# Altium project PCB_Project.PrjPcb
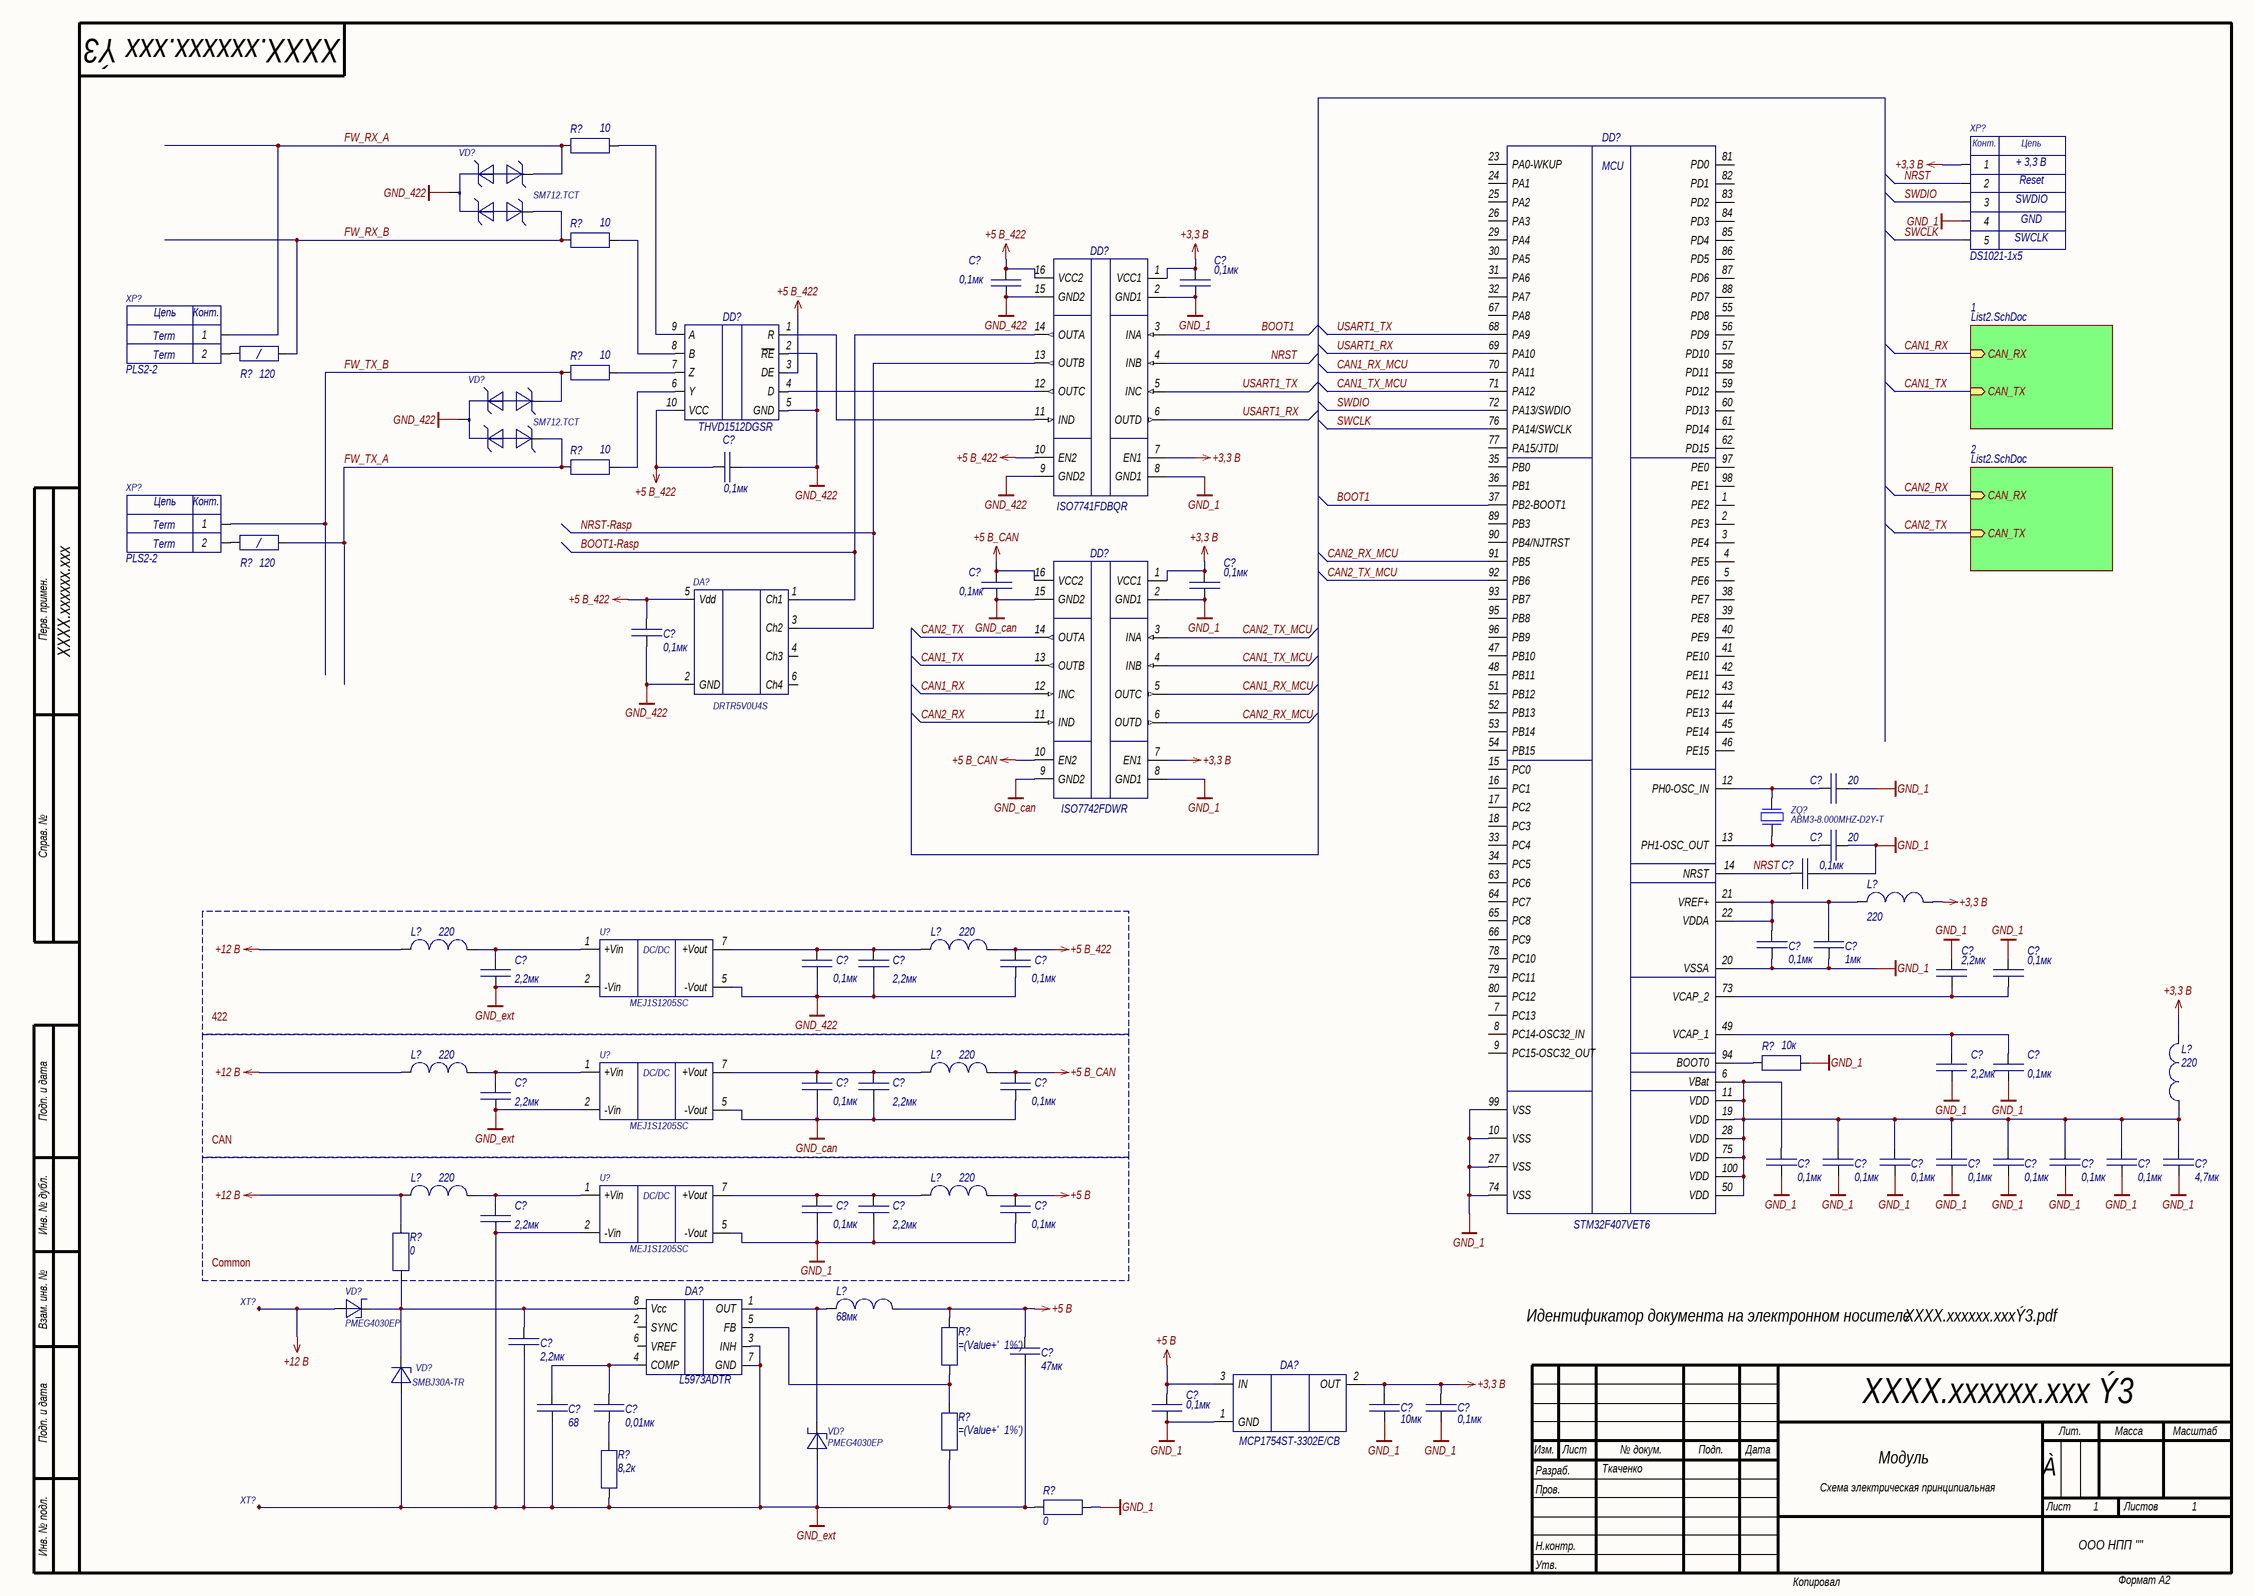
[diagram p0: List1.SchDoc]
DocumentNumber: XXXX.xxxxxx.xxx Ý3; DocumentType2str: Схема электрическая принципиальная; DrawnBy: Ткаченко; IDENT: XXXX.xxxxxx.xxxÝ3.pdf; ImagePath: XXXX.xxxxxx.xxx; Letter1Column: À; Organization: ООО НПП ''''; pcbvalue: КНТР.777777.123; Title2str: Модуль
2 sheets, 104 parts. Net scope: hierarchical (ports join the sheet entries above them; power ports are global).
Board file: pcb.PcbDoc
Sheets:
  List1.SchDoc
    1 = List2.SchDoc
    2 = List2.SchDoc

## Sheet List1.SchDoc
size 594 x 420 mm; DrawnBy: Ткаченко; Organization: ООО НПП ''''; DocumentNumber: XXXX.xxxxxx.xxx Ý3; SheetNumber: 1; SheetTotal: 1; Scale: 1:1; PageSetup: Record=PageOptions|CenterHorizontal=False|CenterVertical=False|PrintScale=0.95|XCorrection=0.00|YCorrection=0.00|PrintKind=1|BorderSize=5000000|LeftOffset=0|BottomOffset=0|Orientation=1|PaperLength=1000|PaperWidth=1000|Scale=100|PaperSource=15|PrintQuality=600|MediaType=1|DitherType=10|PaperKind=A4|PrintScaleMode=1; Title2str: Модуль; DocumentType2str: Схема электрическая принципиальная; TitleProject: Модуль; IDENT: XXXX.xxxxxx.xxxÝ3.pdf; ImagePath: XXXX.xxxxxx.xxx; Rule: PcbType=ProtelPcb

### Parts
(Parts that share a designator on the sheet are numbered #1, #2 ... from top to bottom, then left to right.)
C?#1  0,1мк  [CAPC1608N_SL]
C?#2  0,1мк  [CAPC1608N_SL]
C?#3  0,1мк  [CAPC1608N_SL]
C?#4  0,1мк  [CAPC1608N_SL]
C?#5  0,1мк  [CAPC1608N_SL]
C?#6  0,1мк  [CAPC1608N_SL]
C?#7  20  [CAPC1608N_SL]
C?#8  20  [CAPC1608N_SL]
C?#9  0,1мк  [CAPC1608N_SL]
C?#10  0,1мк  [CAPC1608N_SL]
C?#11  1мк  [CAPC1608N_SL]
C?#12  2,2мк  [CAPC1608N]
C?#13  0,1мк  [CAPC1608N_SL]
C?#14  2,2мк  [CAPC3216N]
C?#15  0,1мк  [CAPC1608N_SL]
C?#16  2,2мк  [CAPC3216N]
C?#17  0,1мк  [CAPC1608N_SL]
C?#18  2,2мк  [CAPC1608N]
C?#19  0,1мк  [CAPC1608N_SL]
C?#20  0,1мк  [CAPC1608N_SL]
C?#21  2,2мк  [CAPC3216N]
C?#22  0,1мк  [CAPC1608N_SL]
C?#23  2,2мк  [CAPC3216N]
C?#24  0,1мк  [CAPC1608N_SL]
C?#25  0,1мк  [CAPC1608N_SL]
C?#26  0,1мк  [CAPC1608N_SL]
C?#27  0,1мк  [CAPC1608N_SL]
C?#28  0,1мк  [CAPC1608N_SL]
C?#29  0,1мк  [CAPC1608N_SL]
C?#30  0,1мк  [CAPC1608N_SL]
C?#31  4,7мк  [CAPC1608N_SL]
C?#32  0,1мк  [CAPC1608N_SL]
C?#33  2,2мк  [CAPC3216N]
C?#34  0,1мк  [CAPC1608N_SL]
C?#35  2,2мк  [CAPC3216N]
C?#36  2,2мк  [CAPC3216N]
C?#37  47мк  [CAPC3225N]
C?#38  68  [CAPC1608N_SL]
C?#39  0,01мк  [CAPC1608N_SL]
C?#40  0,1мк  [CAPC1608N_sl]
C?#41  10мк  [CAPC2012N]
C?#42  0,1мк  [CAPC1608N_sl]
DA?#1  DRTR5V0U4S  [SOT363]
DA?#2  L5973ADTR  [SOIC8(with_termopad)]
DA?#3  MCP1754ST-3302E/CB  [SOT23-3N]
DD?#1  ISO7741FDBQR  [SSOP16]
DD?#2  THVD1512DGSR  [VSOP-10]
DD?#3  ISO7742FDWR  [SO16_N]
DD?#4  STM32F407VET6  [LQFP100]
L?#1  220  [L2012N]
L?#2  220  [L2012N]
L?#3  220  [L2012N]
L?#4  220  [L2012N]
L?#5  220  [L2012N]
L?#6  220  [L2012N]
L?#7  220  [L2012N]
L?#8  220  [L2012N]
L?#9  68мк  [CDRH104R]
R?#1  10  [RESC1608N_SL]
R?#2  10  [RESC1608N_SL]
R?#3  120  [RESC3216N]
R?#4  10  [RESC1608N_SL]
R?#5  10  [RESC1608N_SL]
R?#6  120  [RESC3216N]
R?#7  10к  [RESC1608N_SL]
R?#8  0  [RESC1608N_SL]
R?#9  (no value)  [RESC1608N_SL]
R?#10  (no value)  [RESC1608N_SL]
R?#11  8,2к  [RESC1608N_SL]
R?#12  0  [RESC1608N_SL]
U?#1  MEJ1S1205SC  [MEJ1S1205SC]
U?#2  MEJ1S1205SC  [MEJ1S1205SC]
U?#3  MEJ1S1205SC  [MEJ1S1205SC]
VD?#1  SM712.TCT  [SOT23-3N]
VD?#2  SM712.TCT  [SOT23-3N]
VD?#3  PMEG4030EP  [SOD128]
VD?#4  SMBJ30A-TR  [DO-214AA(SMB)]
VD?#5  PMEG4030EP  [SOD128]
XP?#1  DS1021-1x5  Net_Name1: + 3,3 В  Net_Name2: Reset  Net_Name3: SWDIO  Net_Name4: GND  Net_Name5: SWCLK  [PLS-5]
XP?#2  PLS2-2  Net_Name1: Term  [PLS2-2]
XP?#3  PLS2-2  Net_Name1: Term  [PLS2-2]
XT?#1  PAD  [Pad_1.3X0.8]  (value not drawn)  (no BOM)
XT?#2  PAD  [Pad_1.3X0.8]  (value not drawn)  (no BOM)
ZQ?  ABM3-8.000MHZ-D2Y-T  [ABM3]

### Blocks framed on the sheet
422: C?#13-C?#16 L?#2 L?#3 U?#1

### Sub-sheets
1 = List2.SchDoc: CAN_RX (in), CAN_TX (in)
2 = List2.SchDoc: CAN_RX (in), CAN_TX (in)

### Nets
+3,3 В: C?#2.1 C?#5.1 C?#41.1 C?#42.1 DA?#3.2(OUT) DD?#1.1(VCC1) DD?#1.7(EN1) DD?#3.1(VCC1) DD?#3.7(EN1) L?#1.2 L?#6.2 XP?#1.1
+5 В: C?#34.1 C?#37.1 C?#40.1 DA?#3.3(IN) L?#8.2 L?#9.2 R?#9.2
+5 В_422: C?#1.1 C?#3.1 C?#6.2 C?#15.1 DA?#1.5(Vdd) DD?#1.10(EN2) DD?#1.16(VCC2) DD?#2.3(DE) DD?#2.10(VCC) L?#3.2
+5 В_CAN: C?#4.1 C?#22.1 DD?#3.10(EN2) DD?#3.16(VCC2) L?#5.2
+12 В: L?#2.1 L?#4.1 L?#7.1 R?#8.2 VD?#3.2(A) XT?#1.1
GND_1: C?#2.2 C?#5.2 C?#7.1 C?#8.1 C?#9.1 C?#10.2 C?#11.2 C?#12.2 C?#17.1 C?#18.1 C?#19.2 C?#24.2 C?#25.2 C?#26.2 C?#27.2 C?#28.2 C?#29.2 C?#30.2 C?#31.2 C?#32.2 C?#33.2 C?#34.2 C?#40.2 C?#41.2 C?#42.2 DA?#3.1(GND) DD?#1.2(GND1) DD?#1.8(GND1) DD?#3.2(GND1) DD?#3.8(GND1) DD?#4.10(VSS) DD?#4.20(VSSA) DD?#4.27(VSS) DD?#4.74(VSS) DD?#4.99(VSS) R?#7.2 R?#12.2 U?#3.5(-Vout) XP?#1.4
GND_422: C?#1.2 C?#3.2 C?#6.1 C?#13.2 C?#14.2 C?#15.2 DA?#1.2(GND) DD?#1.9(GND2) DD?#1.15(GND2) DD?#2.2(~{RE}) DD?#2.5(GND) U?#1.5(-Vout) VD?#1.3(C3) VD?#2.3(C3)
GND_can: C?#4.2 C?#20.2 C?#21.2 C?#22.2 DD?#3.9(GND2) DD?#3.15(GND2) U?#2.5(-Vout)
GND_ext: C?#16.2 C?#23.2 C?#35.2 C?#36.2 C?#37.2 C?#38.2 DA?#2.3(INH) DA?#2.7(GND) R?#10.1 R?#11.1 R?#12.1 U?#1.2(-Vin) U?#2.2(-Vin) U?#3.2(-Vin) VD?#4.2 VD?#5.2(A) XT?#2.1
BOOT1: DD?#1.3(INA) DD?#4.37(PB2-BOOT1)
BOOT1-Rasp: DA?#1.1(Ch1) DD?#1.14(OUTA)
CAN1_RX: DD?#3.12(INC) ; sheet 1/CAN_RX
CAN1_RX_MCU: DD?#3.5(OUTC) DD?#4.70(PA11)
CAN1_TX: DD?#3.13(OUTB) ; sheet 1/CAN_TX
CAN1_TX_MCU: DD?#3.4(INB) DD?#4.71(PA12)
CAN2_RX: DD?#3.11(IND) ; sheet 2/CAN_RX
CAN2_RX_MCU: DD?#3.6(OUTD) DD?#4.91(PB5)
CAN2_TX: DD?#3.14(OUTA) ; sheet 2/CAN_TX
CAN2_TX_MCU: DD?#3.3(INA) DD?#4.92(PB6)
FW_RX_A: R?#1.1 VD?#1.1(C1) XP?#2.1
FW_RX_B: R?#2.1 R?#3.2 VD?#1.2(C2)
FW_TX_A: R?#5.1 R?#6.2 VD?#2.2(C2)
FW_TX_B: R?#4.1 VD?#2.1(C1) XP?#3.1
NRST: C?#9.2 DD?#1.4(INB) DD?#4.14(NRST) XP?#1.2
NRST-Rasp: DA?#1.3(Ch2) DD?#1.13(OUTB)
SWCLK: DD?#4.76(PA14/SWCLK) XP?#1.5
SWDIO: DD?#4.72(PA13/SWDIO) XP?#1.3
USART1_RX: DD?#1.6(OUTD) DD?#4.69(PA10)
USART1_TX: DD?#1.5(INC) DD?#4.68(PA9)
NetC?#7_2: C?#7.2 DD?#4.12(PH0-OSC_IN) ZQ?.2
NetC?#8_2: C?#8.2 DD?#4.13(PH1-OSC_OUT) ZQ?.1
NetC?#10_1: C?#10.1 C?#11.1 DD?#4.21(VREF+) DD?#4.22(VDDA) L?#1.1
NetC?#12_1: C?#12.1 C?#17.2 DD?#4.73(VCAP_2)
NetC?#13_1: C?#13.1 C?#14.1 L?#3.1 U?#1.7(+Vout)
NetC?#16_1: C?#16.1 L?#2.2 U?#1.1(+Vin)
NetC?#18_2: C?#18.2 C?#19.1 DD?#4.49(VCAP_1)
NetC?#20_1: C?#20.1 C?#21.1 L?#5.1 U?#2.7(+Vout)
NetC?#23_1: C?#23.1 L?#4.2 U?#2.1(+Vin)
NetC?#24_1: C?#24.1 C?#25.1 C?#26.1 C?#27.1 C?#28.1 C?#29.1 C?#30.1 C?#31.1 DD?#4.6(VBat) DD?#4.11(VDD) DD?#4.19(VDD) DD?#4.28(VDD) DD?#4.50(VDD) DD?#4.75(VDD) DD?#4.100(VDD) L?#6.1
NetC?#32_1: C?#32.1 C?#33.1 L?#8.1 U?#3.7(+Vout)
NetC?#35_1: C?#35.1 L?#7.2 U?#3.1(+Vin)
NetC?#36_1: C?#36.1 DA?#2.8(Vcc) R?#8.1 VD?#3.1(C) VD?#4.1
NetC?#38_1: C?#38.1 C?#39.1 DA?#2.4(COMP)
NetC?#39_2: C?#39.2 R?#11.2
NetDA?#2_1: DA?#2.1(OUT) L?#9.1 VD?#5.1(C)
NetDA?#2_5: DA?#2.5(FB) R?#9.1 R?#10.2
NetDD?#1_11: DD?#1.11(IND) DD?#2.1(R)
NetDD?#1_12: DD?#1.12(OUTC) DD?#2.4(D)
NetDD?#2_6: DD?#2.6(Y) R?#5.2
NetDD?#2_7: DD?#2.7(Z) R?#4.2
NetDD?#2_8: DD?#2.8(B) R?#2.2
NetDD?#2_9: DD?#2.9(A) R?#1.2
NetDD?#4_94: DD?#4.94(BOOT0) R?#7.1
NetR?#3_1: R?#3.1 XP?#2.2
NetR?#6_1: R?#6.1 XP?#3.2

Not connected (* = marked no-connect by the designer): DA?#1 4(Ch3) 6(Ch4); DA?#2 2(SYNC) 6(VREF); DD?#4 1(PE2) 2(PE3) 3(PE4) 4(PE5) 5(PE6) 7(PC13) 8(PC14-OSC32_IN) 9(PC15-OSC32_OUT) 15(PC0) 16(PC1) 17(PC2) 18(PC3) 23(PA0-WKUP) 24(PA1) 25(PA2) 26(PA3) 29(PA4) 30(PA5) 31(PA6) 32(PA7) 33(PC4) 34(PC5) 35(PB0) 36(PB1) 38(PE7) 39(PE8) 40(PE9) 41(PE10) 42(PE11) 43(PE12) 44(PE13) 45(PE14) 46(PE15) 47(PB10) 48(PB11) 51(PB12) 52(PB13) 53(PB14) 54(PB15) 55(PD8) 56(PD9) 57(PD10) 58(PD11) 59(PD12) 60(PD13) 61(PD14) 62(PD15) 63(PC6) 64(PC7) 65(PC8) 66(PC9) 67(PA8) 77(PA15/JTDI) 78(PC10) 79(PC11) 80(PC12) 81(PD0) 82(PD1) 83(PD2) 84(PD3) 85(PD4) 86(PD5) 87(PD6) 88(PD7) 89(PB3) 90(PB4/NJTRST) 93(PB7) 95(PB8) 96(PB9) 97(PE0) 98(PE1)

### Notes on the sheet
- CAN
- Common
- Перв. примен.
- Справ. №
- Подп. и дата
- Инв. № дубл.
- Взам. инв. №
- Идентификатор документа на электронном носителе
- Изм.
- Лист
- № докум.
- Подп.
- Дата
- Лит.
- Масса
- Масштаб
- Пров.
- Разраб.
- Листов
- Инв. № подл.
- Н.контр.
- Утв.
- Копировал
- Формат А2
- (in symbol DS1021-1x5_Сonnfly) Конт.; Цепь
- (in symbol MEJ1S1205SC_Murata Electronics) DC/DC
- (in symbol PLS2-2_CONNFLY) Цепь; Конт.
- (in symbol STM32F407VET6_STMicroelectronics) MCU

### Library data of the parts
C?#1-C?#6 C?#9 C?#10 C?#13 C?#15 C?#17 C?#19 C?#20 C?#22 C?#24-C?#30 C?#32 C?#34 = CC0603KRX7R0BB104_Yageo: 0.1µF ±10% 100V Ceramic Capacitor X7R 0603 (1608 Metric); Manufacturer: Yageo; Voltage: 100 В; ValueBOM: Конденсатор CC0603KRX7R0BB104 "Yageo" (0,1 мкФ ± 10 %, 100 В, X7R, SMD 0603); Sorting: 100000; Автор: Ткаченко М.; Количество1: 1; Цена1: 0,21; Количество2: 10; Цена2: 0,14; Разрешен к применению: True; PartNumber: CC0603KRX7R0BB104_Yageo; ManufacturerPartNumber: CC0603KRX7R0BB104; ComponentLink3URL: http://www.yageo.com/documents/recent/UPY-NP0X7R_MV_100-to-630V_18.pdf; ComponentLink3Description: Datasheet; Value: 0,1мк; Tolerance: ± 10 %; TKE: X7R; ComponentLink2Description: Manufacturer Link; ComponentLink2URL: http://www.yageo.com/; Operating Temperature: -55°C ~ +125°C; Modify: 27.02.2017 8:51:43; Supplier: Digi-Key; Supplier P/N: 311-1523-1-ND
C?#7 C?#8 = CC0603JRNPO9BN200_Yageo: CAP CER 20PF 50V 5% NPO 0603; Manufacturer: Yageo; Voltage: 50 В; TKE: NP0; ValueBOM: Конденсатор CC0603JRNPO9BN200 "Yageo" (20 пФ ± 10 %, 50 В,NP0, SMD 0603); Автор: Хоменко С.П.; Количество1: 10; Цена1: 0,031; Количество2: 25; Цена2: 0,0216; Разрешен к применению: True; PartNumber: CC0603JRNPO9BN200_Yageo; ManufacturerPartNumber: CC0603JRNPO9BN200; ComponentLink3URL: http://www.yageo.com/documents/recent/UPY-GPHC_X7R_6.3V-to-50V-v12.pdf; ComponentLink3Description: Datasheet; Value: 20; Tolerance: ± 5 %; ComponentLink2Description: Manufacturer Link; ComponentLink2URL: http://www.yageo.com/; Operating Temperature: -55°C ~ +125°C; Modify: 12.08.2015; Supplier: Digi-Key; Supplier P/N: 311-1424-1-ND; Sorting: 20
C?#11 = CC0603KRX7R7BB105_Yageo: CAP CER 1UF 16V 10% X7R 0603; Manufacturer: Yageo; Voltage: 16 В; ValueBOM: Конденсатор CC0603KRX7R7BB105 "Yageo" (1 мкФ ± 10 %, 16 В,X7R, SMD 0603); Sorting: 1000000; Автор: Хоменко С.П.; Количество1: 10; Цена1: 0,44; Количество2: 25; Цена2: 0,031; Разрешен к применению: True; PartNumber: CC0603KRX7R7BB105_Yageo; ManufacturerPartNumber: CC0603KRX7R7BB105; ComponentLink3URL: http://www.yageo.com/documents/recent/UPY-GPHC_X7R_6.3V-to-50V-v12.pdf; ComponentLink3Description: Datasheet; Value: 1мк; Tolerance: ± 10 %; TKE: X7R; ComponentLink2Description: Manufacturer Link; ComponentLink2URL: http://www.yageo.com/; Operating Temperature: -55°C ~ +125°C; Modify: 12.08.2015 16:30:29; Supplier: Digi-Key; Supplier P/N: 311-1446-1-ND
C?#12 C?#18 = GRM188R71A225KE15D_Murata Electronics: CAP CER 2.2UF 10V X7R 0603; Tolerance: ± 10 %; Voltage: 10 В; ValueBOM: Конденсатор GRM188R71A225KE15D "Murata Electronics" (2,2 мкФ ± 10 %, 10 В, X7R, SMD 0603); Sorting: 2200000; Автор: Хоменко С.П.; Количество1: 1; Цена1: 0,34; Количество2: 10; Цена2: 0,28; Разрешен к применению: False; PartNumber: GRM188R71A225KE15D_Murata Electronics; Manufacturer: Murata Electronics; ManufacturerPartNumber: GRM188R71A225KE15D; ComponentLink3URL: http://www.murata.com/~/media/webrenewal/support/library/catalog/products/capacitor/mlcc/c02e.pdf; ComponentLink3Description: Datasheet; Value: 2,2мк; TKE: X7R; ComponentLink2Description: Manufacturer Link; ComponentLink2URL: http://www.murata.com/; Operating Temperature: -55°C ~ +125°C; Modify: 29.03.2016 8:54:49; Supplier: Digi-Key; Supplier P/N: 490-4520-1-ND
C?#14 C?#16 C?#21 C?#23 C?#33 C?#35 C?#36 = CC1206KKX7R9BB225_Yageo: CAP CER 2.2UF 50V 10% X7R 1206; Manufacturer: Yageo; Voltage: 50 В; ValueBOM: Конденсатор CC1206KKX7R9BB225 "Yageo" (2,2 мкФ ± 10 %, 50 В, X7R, SMD 1206); Sorting: 2200000; Автор: Хоменко С.П.; Количество1: 10; Цена1: 0,292; Количество2: 25; Цена2: 0,201; Разрешен к применению: True; PartNumber: CC1206KKX7R9BB225_Yageo; ManufacturerPartNumber: CC1206KKX7R9BB225; ComponentLink3URL: http://www.yageo.com/documents/recent/UPY-GPHC_X7R_6.3V-to-50V-v12.pdf; ComponentLink3Description: Datasheet; Value: 2,2мк; Tolerance: ± 10 %; TKE: X7R; ComponentLink2Description: Manufacturer Link; ComponentLink2URL: http://www.yageo.com/; Operating Temperature: -55°C ~ +125°C; Modify: 13.08.2015; Supplier: Digi-Key; Supplier P/N: 311-1964-1-ND; Package Description: Chip Capasitor, 2-Leads, Body 3,2x1,6mm, IPC Medium Density
C?#31 = CC0603KRX5R6BB475_Yageo: CAP CER 4.7UF 10V 10% X5R 0603; Manufacturer: Yageo; Voltage: 10 В; ValueBOM: Конденсатор CC0603KRX5R6BB475 "Yageo" (4,7 мкФ ± 10 %, 10 В, X5R, SMD 0603); Sorting: 4700000; Автор: Хоменко С.П.; Количество1: 1; Цена1: 0,14; Количество2: 10; Цена2: 0,095; Разрешен к применению: False; PartNumber: CC0603KRX5R6BB475_Yageo; ManufacturerPartNumber: CC0603KRX5R6BB475; ComponentLink3URL: http://www.yageo.com/documents/recent/UPY-GPHC_X5R_4V-to-50V_19.pdf; ComponentLink3Description: Datasheet; Value: 4,7мк; Tolerance: ± 10 %; TKE: X5R; ComponentLink2Description: Manufacturer Link; ComponentLink2URL: http://www.yageo.com/; Operating Temperature: -55°C ~ +125°C; Modify: 12.08.2015 16:02:03; Supplier: Digi-Key; Supplier P/N: 311-1455-1-ND
C?#37 = GRM32ER71A476KE15L_Murata Electronics: 47µF ±10% 10V Ceramic Capacitor X7R 1210 (3225 Metric); Tolerance: ± 20 %; Voltage: 10 В; ValueBOM: Конденсатор GRM32ER71A476KE15L "Murata Electronics" (47 мкФ ± 20 %, 10 В, X7R, SMD 1210); Sorting: 47000000; Автор: Хоменко С.П.; Количество1: 10; Цена1: 0,767; Количество2: 250; Цена2: 0,51108; Разрешен к применению: True; PartNumber: GRM32ER71A476KE15L_Murata Electronics; Manufacturer: Murata Electronics; ManufacturerPartNumber: GRM32ER71A476KE15L; ComponentLink3URL: http://www.murata.com/~/media/webrenewal/support/library/catalog/products/capacitor/mlcc/c02e.ashx; ComponentLink3Description: Datasheet; Value: 47мк; TKE: X7R; ComponentLink2Description: Manufacturer Link; ComponentLink2URL: http://www.murata.com/; Operating Temperature: -55°C ~ +125°C; Modify: 20.03.2017; Supplier: Digi-Key; Supplier P/N: 490-5312-1-ND; Package Description: Конденсатор керамический тип-размер 1210(3225)
C?#38 = CC0603JRNPO9BN680_Yageo: CAP CER 68PF 50V NPO 0603; Manufacturer: Yageo; Tolerance: ± 5 %; Voltage: 50 В; TKE: NP0; ValueBOM: Конденсатор CC0603JRNPO9BN680 "Yageo" (68 пФ ± 5 %, 50 В, NP0, SMD 0603); Автор: Хоменко С.П.; Количество1: 10; Цена1: 0,029; Количество2: 25; Цена2: 0,0204; Разрешен к применению: True; PartNumber: CC0603JRNPO9BN680_Yageo; ManufacturerPartNumber: CC0603JRNPO9BN680; ComponentLink3URL: http://www.yageo.com/documents/recent/UPY-GP_NP0_16V-to-50V_10.pdf; ComponentLink3Description: Datasheet; Value: 68; ComponentLink2Description: Manufacturer Link; ComponentLink2URL: http://www.yageo.com/; Operating Temperature: -55°C ~ +125°C; Modify: 22.01.2016; Supplier: Digi-Key; Sorting: 68
C?#39 = CC0603KPX7R9BB103_Yageo: CAP CER 10000PF 50V 10% X7R 0603; Manufacturer: Yageo; Voltage: 50 В; ValueBOM: Конденсатор CC0603KPX7R9BB103 "Yageo" (0,01 мкФ ± 10 %, 50 В,X7R, SMD 0603); Sorting: 10000; Автор: Хоменко С.П.; Количество1: 10; Цена1: 0,019; Количество2: 100; Цена2: 0,0089; Разрешен к применению: True; PartNumber: CC0603KPX7R9BB103_Yageo; ManufacturerPartNumber: CC0603KPX7R9BB103; ComponentLink3URL: http://www.yageo.com/documents/recent/UPY-GPHC_X7R_6.3V-to-50V-v12.pdf; ComponentLink3Description: Datasheet; Value: 0,01мк; Tolerance: ± 10 %; TKE: X7R; ComponentLink2Description: Manufacturer Link; ComponentLink2URL: http://www.yageo.com/; Operating Temperature: -55°C ~ +125°C; Modify: 06.07.2015; Supplier: Digi-Key; Supplier P/N: 311-1572-1-ND
C?#40 C?#42 = CC0603KRX7R9BB104_Yageo: CAP CER 0.1UF 50V 10% X7R 0603; Manufacturer: Yageo; Voltage: 50 В; ValueBOM: Конденсатор CC0603KRX7R9BB104 "Yageo" (0,1 мкФ ± 10 %, 50 В,X7R, SMD 0603); Sorting: 100000; Автор: Хоменко С.П.; Количество1: 10; Цена1: 0,027; Количество2: 100; Цена2: 0,0125; Разрешен к применению: True; PartNumber: CC0603KRX7R9BB104_Yageo; ManufacturerPartNumber: CC0603KRX7R9BB104; ComponentLink3URL: http://www.yageo.com/documents/recent/UPY-GPHC_X7R_6.3V-to-50V-v12.pdf; ComponentLink3Description: Datasheet; Value: 0,1мк; Tolerance: ± 10 %; TKE: X7R; ComponentLink2Description: Manufacturer Link; ComponentLink2URL: http://www.yageo.com/; Operating Temperature: -55°C ~ +125°C; Modify: 06.07.2015; Supplier: Digi-Key; Supplier P/N: 311-1344-1-ND
C?#41 = CC0805KKX5R7BB106_Yageo: CAP CER 10UF 16V 10% X5R 0805; Manufacturer: Yageo; Voltage: 16 В; ValueBOM: Конденсатор CC0805KKX5R7BB106 "Yageo" (10 мкФ ± 10 %, 16 В, X5R, SMD 0805); Sorting: 10000000; Автор: Хоменко С.П.; Количество1: 10; Цена1: 0,134; Количество2: 100; Цена2: 0,06810; Разрешен к применению: True; PartNumber: CC0805KKX5R7BB106_Yageo; ManufacturerPartNumber: CC0805KKX5R7BB106; ComponentLink3URL: http://www.yageo.com/documents/recent/UPY-GPHC_X7R_6.3V-to-50V-v12.pdf; ComponentLink3Description: Datasheet; Value: 10мк; Tolerance: ± 10 %; TKE: X5R; ComponentLink2Description: Manufacturer Link; ComponentLink2URL: http://www.yageo.com/; Operating Temperature: -55°C ~ +125°C; Modify: 14.08.2015; Supplier: Digi-Key; Supplier P/N: 311-1865-1-ND
DA?#1 = DRTR5V0U4S_Diodes Incorporated: TVS DIODE 5.5VWM SOT363; ValueBOM: Микросхема DRTR5V0U4S Diodes Incorporated; Marking: TG1; Voltage: 5 В; Автор: Ткаченко М.; Количество1: 1; Цена1: 0,4; Количество2: 10; Цена2: 0,32; Разрешен к применению: True; PartNumber: DRTR5V0U4S_Diodes Incorporated; ManufacturerPartNumber: DRTR5V0U4S; Manufacturer: Diodes Incorporated; ComponentLink3URL: http://www.diodes.com/_files/datasheets/DRTR5V0U4S.pdf; ComponentLink3Description: Datasheet; Value: DRTR5V0U4S; ComponentLink2Description: Manufacturer Link; ComponentLink2URL: http://www.diodes.com/; Operating Temperature: -65°C ~ +150°С; Modify: 29.08.2016 14:27:04; Supplier: Digi-Key; Supplier P/N: DRTR5V0U4S-7DICT-ND
DA?#2 = L5973ADTR_STMicroelectronics: IC REG BUCK ADJ 2A 8SOIC; ValueBOM: Микросхема  L5973ADTR "STMicroelectronics"; Expr1007: 4 В -36 В; Автор: Ткаченко М.; Количество1: 1; Цена1: 2,64; Количество2: 10; Цена2: 2,4; Разрешен к применению: True; PartNumber: L5973ADTR_STMicroelectronics; ManufacturerPartNumber: L5973ADTR; Manufacturer: STMicroelectronics; ComponentLink3URL: https://www.st.com/content/ccc/resource/technical/document/datasheet/cb/fb/4a/2d/ed/b0/40/06/CD00003370.pdf/files/CD00003370.pdf/jcr:content/translations/en.CD00003370.pdf; ComponentLink3Description: Datasheet; Value: L5973ADTR; Expr1008: 2 A; ComponentLink2Description: Manufacturer Link; ComponentLink2URL: http://www.st.com; Operating Temperature: -40°C ~ +150°C; Modify: 15.03.2019 16:28:28; Supplier: Digi-Key; Supplier P/N: 497-5328-1-ND; Package Description: Корпус SOIC8 с термоплощадкой; Voltage: 4 В -36 В; Current: 2 A; Package: SOIC8(with_termopad); SMD mounting: True
DA?#3 = MCP1754ST-3302E/CB_Microchip Technology: IC REG LDO 3.3V 0.15A SOT23A-3; ValueBOM: Микросхема  MCP1754ST-3302E/CB "Microchip Technology" SOT23-3; Marking: JD; Автор: Хоменко С.П.; Количество1: 1; Цена1: 0,48; Количество2: 10; Цена2: 0,4; Разрешен к применению: True; PartNumber: MCP1754ST-3302E/CB_Microchip Technology; ManufacturerPartNumber: MCP1754ST-3302E/CB; Manufacturer: Microchip Technology; ComponentLink3URL: http://ww1.microchip.com/downloads/en/DeviceDoc/20002276C.pdf; ComponentLink3Description: Datasheet; Value: MCP1754ST-3302E/CB; ComponentLink2Description: Manufacturer Link; ComponentLink2URL: http://www.microchip.com/; Operating Temperature: -40°C ~ +125°C; Modify: 11.08.2015 17:28:07; Supplier: Digi-Key; Supplier P/N: MCP1754ST-3302E/CBCT-ND; Package Description: SOT23, 3-Leads, Body 2.9x1.3mm, Pitch 0.95mm, Lead Span 2.5mm, IPC Medium Density
DD?#1 = ISO7741FDBQR_Texas Instruments: General Purpose Digital Isolator 5000Vrms 4 Channel 100Mbps 85kV/µs CMTI 16-SSOP (0.154", 3.90mm Width); ValueBOM: Микросхема  ISO7741FDBQR "Texas Instruments"; Voltage: 5,0 В; Автор: Ткаченко М.; Количество1: 1; Цена1: 2,96; Количество2: 10; Цена2: 2,66; Разрешен к применению: True; PartNumber: ISO7741FDBQR_Texas Instruments; ManufacturerPartNumber: ISO7741FDBQR; Manufacturer: Texas Instruments; ComponentLink3URL: http://www.ti.com/lit/ds/symlink/iso7742.pdf; ComponentLink3Description: Datasheet; Value: ISO7741FDBQR; ComponentLink2Description: Manufacturer Link; ComponentLink2URL: http://www.ti.com/; Operating Temperature: -55°C ~ +125°C; Modify: 14.03.2019 18:10:18; Supplier: Digi-Key; Supplier P/N: 296-48140-1-ND
DD?#2 = THVD1512DGSR_Texas Instruments: 1/1 Transceiver Full RS485 10-VSSO; ValueBOM: Микросхема  THVD1512DGSR "Texas Instruments"; Voltage: 5,0 В; Current: 50 мА; Автор: Ткаченко М.; Количество1: 1; Цена1: 2,58; Количество2: 10; Цена2: 2,3; Разрешен к применению: True; PartNumber: THVD1512DGSR_Texas Instruments; ManufacturerPartNumber: THVD1512DGSR; Manufacturer: Texas Instruments; ComponentLink3URL: http://www.ti.com/lit/ds/symlink/thvd1510.pdf; ComponentLink3Description: Datasheet; Value: THVD1512DGSR; ComponentLink2Description: Manufacturer Link; ComponentLink2URL: http://www.ti.com/; Operating Temperature: -40°C ~ +85°C; Modify: 15.03.2019 18:33:02; Supplier: Digi-Key; Supplier P/N: 296-51652-1-ND
DD?#3 = ISO7742FDWR_Texas Instruments: General Purpose Digital Isolator 5000Vrms 4 Channel 100Mbps 85kV/µs CMTI 16-SOIC (0.295", 7.50mm Width); ValueBOM: Микросхема  ISO7742FDWR "Texas Instruments" SOIC-16; Voltage: 5,0 В; Автор: Ткаченко М.; Количество1: 1; Цена1: 3,2; Количество2: 10; Цена2: 2,9; Разрешен к применению: True; PartNumber: ISO7742FDWR_Texas Instruments; ManufacturerPartNumber: ISO7742FDWR; Manufacturer: Texas Instruments; Value: ISO7742FDWR; Operating Temperature: -40°C ~ +85°C; Modify: 15.03.2019 22:34:01; Supplier: Digi-Key; Supplier P/N: 296-44610-1-ND; ComponentLink3URL: http://www.ti.com/lit/ds/symlink/iso7742.pdf; ComponentLink3Description: Datasheet; ComponentLink2Description: Manufacturer Link; ComponentLink2URL: http://www.ti.com/
DD?#4 = STM32F407VET6_STMicroelectronics: IC MCU 32BIT 512KB FLASH 100LQFP; ValueBOM: Микросхема  STM32F407VET6 "STMicroelectronics"; Voltage: 3,3 В; Автор: Ткаченко М.; Количество1: 1; Цена1: 11,4; Количество2: 30; Цена2: 9,8; Разрешен к применению: True; PartNumber: STM32F407VET6_STMicroelectronics; ManufacturerPartNumber: STM32F407VET6; Manufacturer: STMicroelectronics; ComponentLink3URL: https://www.st.com/content/ccc/resource/technical/document/datasheet/ef/92/76/6d/bb/c2/4f/f7/DM00037051.pdf/files/DM00037051.pdf/jcr:content/translations/en.DM00037051.pdf; ComponentLink3Description: Datasheet; Value: STM32F407VET6; ComponentLink2Description: Manufacturer Link; ComponentLink2URL: http://www.st.com; Operating Temperature: -40°C ~ +85°C; Modify: 14.03.2019 16:09:14; Supplier: Digi-Key; Supplier P/N: 497-12075-ND
L?#1-L?#8 = BLM21PG221SN1D_Murata Electronics: FERRITE BEAD 220 OHM 0805 2A; Tolerance: ± 25 %; ValueBOM: Индуктивность BLM21PG221SN1D "Murata Electronics" (220Гн, ± 25 %, SMD 0805); Sorting: 2; Автор: Хоменко С.П.; Количество1: 10; Цена1: 0,09; Количество2: 50; Цена2: 0,0732; Разрешен к применению: True; PartNumber: BLM21PG221SN1D_Murata Electronics; Manufacturer: Murata Electronics; ManufacturerPartNumber: BLM21PG221SN1D; ComponentLink3URL: http://search.murata.co.jp/Ceramy/image/img/PDF/ENG/L0110S0100BLM21P.pdf; ComponentLink3Description: Datasheet; Value: 220; ComponentLink2Description: Manufacturer Link; ComponentLink2URL: http://www.murata.com/; Operating Temperature: -55°C ~ +125°C; Modify: 02.02.2016; Supplier: Digi-Key; Supplier P/N: 490-1054-1-ND; Package Description: Chip Ferrite Bead SMD0805, Body 2.0x1.3mm, IPC Medium Density
L?#9 = CDRH104RNP-680NC_Sumida: FIXED IND 68UH 1.42A 213 MOHM; Manufacturer: Sumida; Tolerance: ± 30 %; ValueBOM: Индуктивность CDRH104RNP-680NC "Sumida" (68мкГн, ± 30 %); Marking: 680; Sorting: 68; Автор: Хоменко С.П.; Количество1: 10; Цена1: 1,172; Количество2: 50; Цена2: 0,161; Разрешен к применению: True; PartNumber: CDRH104RNP-680NC_Sumida; ManufacturerPartNumber: CDRH104RNP-680NC; ComponentLink3URL: http://products.sumida.com/products/pdf/CDRH104R.pdf; ComponentLink3Description: Datasheet; Value: 68мк; ComponentLink2Description: Manufacturer Link; ComponentLink2URL: http://sumida.com/; Operating Temperature: -40°C ~ +105°C; Modify: 13.08.2015 11:56:48; Supplier: Digi-Key; Supplier P/N: 308-2170-1-ND
R?#1 R?#2 R?#4 R?#5 = RC0603JR-0710RL_Yageo: RES SMD 10 OHM 5% 1/10W 0603; Manufacturer: Yageo; Power: 0,1 Вт; ValueBOM: Резистор RC0603JR-0710RL "Yageo" (10 Ом ± 5 %, 0,1 Вт SMD 0603); ТКС: ±200ppm/C°; Marking: 100; Автор: Хоменко С.П.; Цена1: 0,011; Количество2: 25; Цена2: 0,008; Разрешен к применению: True; PartNumber: RC0603JR-0710RL_Yageo; ManufacturerPartNumber: RC0603JR-0710RL; ComponentLink3URL: http://www.yageo.com/NewPortal/yageodocoutput?fileName=/pdf/R-Chip/PYu-RC_Group_51_RoHS_L_3.pdf; ComponentLink3Description: Datasheet; Value: 10; Tolerance: ± 5 %; ComponentLink2Description: Manufacturer Link; ComponentLink2URL: http://www.yageo.com/; Operating Temperature: -55°C ~ +125°C; Modify: 12.08.2015 22:38:32; Supplier: Digi-Key; Supplier P/N: 311-22GRCT-ND; Sorting: 10; Package Description: Chip Resistor, Body 1.6x0.8mm, IPC Medium Density; Количество1: 10
R?#3 R?#6 = RC1206JR-07120RL_Yageo: 120 Ohm ±5% 0.25W, 1/4W Chip Resistor 1206 (3216 Metric) Moisture Resistant Thick Film; Manufacturer: Yageo; Power: 0,25 Вт; ValueBOM: Резистор RC1206JR-07120RL "Yageo" (120 Ом ± 5 %, 0,25 Вт SMD 1206); ТКС: ±200ppm/C°; Marking: 121; Автор: Ткаченко М.; Количество1: 1; Цена1: 0,10; Количество2: 10; Цена2: 0,22; Разрешен к применению: True; PartNumber: RC1206JR-07120RL_Yageo; ManufacturerPartNumber: RC1206JR-07120RL; ComponentLink3URL: http://www.yageo.com.tw/exep/pages/download/literatures/PYu-R_INT-thick_7.pdf; ComponentLink3Description: Datasheet; Value: 120; Tolerance: ± 5 %; ComponentLink2Description: Manufacturer Link; ComponentLink2URL: http://www.yageo.com/; Operating Temperature: -55°C ~ +155°C; Modify: 01.03.2017 9:26:19; Supplier: Digi-Key; Supplier P/N: 311-200ERCT-ND; Sorting: 120; Package Description: Chip Resistor, Body 3,2x1.6mm, IPC Medium Density
R?#7 = RC0603JR-0710KL_Yageo: RES SMD 10K OHM 5% 1/10W 0603; Manufacturer: Yageo; Power: 0,1 Вт; ValueBOM: Резистор RC0603JR-0710KL "Yageo" (10 кОм ± 5 %, 0,1 Вт SMD 0603); ТКС: ±100ppm/C°; Marking: 103; Sorting: 10000; Автор: Хоменко С.П.; Количество1: 10; Цена1: 0,011; Количество2: 25; Цена2: 0,008; Разрешен к применению: True; PartNumber: RC0603JR-0710KL_Yageo; ManufacturerPartNumber: RC0603JR-0710KL; ComponentLink3URL: http://www.yageo.com/NewPortal/yageodocoutput?fileName=/pdf/R-Chip/PYu-RC_Group_51_RoHS_L_3.pdf; ComponentLink3Description: Datasheet; Value: 10к; Tolerance: ± 5 %; ComponentLink2Description: Manufacturer Link; ComponentLink2URL: http://www.yageo.com/; Operating Temperature: -55°C ~ +125°C; Modify: 12.08.2015 22:38:32; Supplier: Digi-Key; Supplier P/N: 311-10KGRCT-ND; Package Description: Chip Resistor, Body 1.6x0.8mm, IPC Medium Density
R?#8 R?#12 = RC0603JR-070RL_Yageo: RES SMD 0.0OHM JUMPER 1/10W 0603; Manufacturer: Yageo; Tolerance: ± 5 %; Power: 0,1 Вт; ValueBOM: Резистор RC0603JR-070RL "Yageo" (0 Ом ± 5 %, 0,1 Вт SMD 0603); ТКС: ±100ppm/C°; Автор: Хоменко С.П.; Количество1: 10; Цена1: 0,011; Количество2: 25; Цена2: 0,008; Разрешен к применению: True; PartNumber: RC0603JR-070RL_Yageo; ManufacturerPartNumber: RC0603JR-070RL; ComponentLink3URL: http://www.yageo.com/NewPortal/yageodocoutput?fileName=/pdf/R-Chip/PYu-RC_Group_51_RoHS_L_3.pdf; ComponentLink3Description: Datasheet; Value: 0; ComponentLink2Description: Manufacturer Link; ComponentLink2URL: http://www.yageo.com/; Operating Temperature: -55°C ~ +125°C; Marking: 0; Modify: 27.08.2015; Supplier: Digi-Key; Supplier P/N: 311-0.0GRCT-ND; Sorting: 0; Package Description: Chip Resistor, Body 1.6x0.8mm, IPC Medium Density
R?#9 = RC0603FR-076K8L_Yageo: RES SMD 6,8к  1% 1/10W 0603; Manufacturer: Yageo; Value: 6,8к; Power: 0,1 Вт; ValueBOM: Резистор RC0603FR-076K8L "Yageo" (6,8 кОм ± 1 %, 0,1 Вт SMD 0603); ТКС: ±100ppm/C°; Marking: 6801; Sorting: 6800; Автор: Хоменко С.П.; Количество1: 10; Цена1: 0,014; Количество2: 25; Цена2: 0,01; Разрешен к применению: True; PartNumber: RC0603FR-076K8L_Yageo; ManufacturerPartNumber: RC0603FR-076K8L; ComponentLink3URL: http://www.yageo.com/NewPortal/yageodocoutput?fileName=/pdf/R-Chip/PYu-RC_Group_51_RoHS_L_3.pdf; ComponentLink3Description: Datasheet; Tolerance: ± 1 %; ComponentLink2Description: Manufacturer Link; ComponentLink2URL: http://www.yageo.com/; Operating Temperature: -55°C ~ +155°C; Modify: 12.08.2015; Supplier: Digi-Key; Package Description: Chip Resistor, Body 1.6x0.8mm, IPC Medium Density
R?#10 = RC0603FR-072K2L_Yageo: RES SMD 2,2к  1% 1/10W 0603; Manufacturer: Yageo; Value: 2,2к; Power: 0,1 Вт; ValueBOM: Резистор RC0603FR-072K2L Yageo; ТКС: ±100ppm/C°; Marking: 2201; Sorting: 2200; Автор: Хоменко С.П.; Количество1: 10; Цена1: 0,014; Количество2: 25; Цена2: 0,01; Разрешен к применению: True; PartNumber: RC0603FR-072K2L_Yageo; ManufacturerPartNumber: RC0603FR-072K2L; ComponentLink3URL: http://www.yageo.com/NewPortal/yageodocoutput?fileName=/pdf/R-Chip/PYu-RC_Group_51_RoHS_L_3.pdf; ComponentLink3Description: Datasheet; Tolerance: ± 1 %; ComponentLink2Description: Manufacturer Link; ComponentLink2URL: http://www.yageo.com/; Operating Temperature: -55°C ~ +155°C; Modify: 12.08.2015; Supplier: Digi-Key; Supplier P/N: 311-1.10KHRCT-ND; Package Description: Chip Resistor, Body 1.6x0.8mm, IPC Medium Density
R?#11 = RC0603JR-078K2L_Yageo: RES SMD 8,2к  1% 1/10W 0603; Manufacturer: Yageo; Tolerance: ± 5 %; Power: 0,1 Вт; ValueBOM: Резистор RC0603JR-078K2L "Yageo" (8,2 кОм ± 5 %, 0,1 Вт SMD 0603); ТКС: ±100ppm/C°; Marking: 822; Sorting: 8200; Автор: Хоменко С.П.; Количество1: 10; Цена1: 0,014; Количество2: 25; Цена2: 0,01; Разрешен к применению: True; PartNumber: RC0603JR-078K2L_Yageo; ManufacturerPartNumber: RC0603JR-078K2L; ComponentLink3URL: http://www.yageo.com/NewPortal/yageodocoutput?fileName=/pdf/R-Chip/PYu-RC_Group_51_RoHS_L_3.pdf; ComponentLink3Description: Datasheet; Value: 8,2к; ComponentLink2Description: Manufacturer Link; ComponentLink2URL: http://www.yageo.com/; Operating Temperature: -55°C ~ +155°C; Modify: 12.08.2015; Supplier: Digi-Key; Supplier P/N: 311-1.5KGRCT-ND; Package Description: Chip Resistor, Body 1.6x0.8mm, IPC Medium Density
U?#1-U?#3 = MEJ1S1205SC_Murata Electronics: DC DC CONVERTER 5V 1W; Tolerance: ± 1 %; Voltage: 5,0 В; Current: 0,2 A; ValueBOM: DC-DC преобразователь MEJ1S1205SC "Murata Electronics"; Автор: Ткаченко М.; Количество1: 1; Цена1: 8,91; Количество2: 10; Цена2: 8,81; Разрешен к применению: True; PartNumber: MEJ1S1205SC_Murata Electronics; Manufacturer: Murata Electronics; ManufacturerPartNumber: MEJ1S1205SC; ComponentLink3URL: https://power.murata.com/pub/data/power/ncl/kdc_mej1.pdf; ComponentLink3Description: Datasheet; Value: MEJ1S1205SC; ComponentLink2Description: Manufacturer Link; ComponentLink2URL: http://www.murata.com/; Operating Temperature: -40°C ~ +85°C; Modify: 15.03.2019 15:17:48; Supplier: Digi-Key; Supplier P/N: 811-3013-5-ND
VD?#1 VD?#2 = SM712.TCT_Semtech Corporation: TVS DIODE 12V/7V 26V/12V SOT23-3; ValueBOM: TVS диод SM712.TCT "STMicroelectronics" 	SO23-3; Marking: 712; Voltage: -7 В - 12 В; Автор: Ткаченко М.; Количество1: 1; Цена1: 1,8; Количество2: 500; Цена2: 1,05; Разрешен к применению: True; PartNumber: SM712.TCT_Semtech Corporation; ManufacturerPartNumber: SM712.TCT; Manufacturer: Semtech Corporation; ComponentLink3URL: https://www.semtech.com/uploads/documents/sm712.pdf; ComponentLink3Description: Datasheet; Value: SM712.TCT; ComponentLink2Description: Manufacturer Link; ComponentLink2URL: https://www.semtech.com/; Operating Temperature: -40°C ~ +85°C; Modify: 23.02.2019 13:32:50; Supplier: Digi-Key; Supplier P/N: SM712CT-ND; Package Description: SOT23, 3-Leads, Body 2.9x1.3mm, Pitch 0.95mm, Lead Span 2.5mm, IPC Medium Density
VD?#3 VD?#5 = PMEG4030EP_NXP Semiconductors: DIODE SCHOTTKY 40V 3A SOD128; ValueBOM: Диод PMEG4030EP "NXP Semiconductors"; Marking: AE; Voltage: 40 В; Current: 3 А; Автор: Хоменко С.П.; Количество1: 10; Цена1: 0,371; Количество2: 25; Цена2: 0,3248; Разрешен к применению: True; PartNumber: PMEG4030EP_NXP Semiconductors; ManufacturerPartNumber: PMEG4030EP; Manufacturer: NXP Semiconductors; ComponentLink3URL: http://www.nxp.com/documents/data_sheet/PMEG4030EP.pdf; ComponentLink3Description: Datasheet; Value: PMEG4030EP; ComponentLink2Description: Manufacturer Link; ComponentLink2URL: http://www.nxp.com/; Operating Temperature: -55°C ~ +150°C; Modify: 12.08.2015 14:32:16; Supplier: Digi-Key; Supplier P/N: 568-7407-1-ND; Package Description: SODFL, 2-Leads, Body 2,50x4,70mm, IPC Low Density
VD?#4 = SMBJ30A-TR_STMicroelectronics: TVS DIODE 30VWM 64.3VC SMB; ValueBOM: TVS диод SMBJ30A-TR "STMicroelectronics"; Marking: BUM; Автор: Хоменко С.П.; Количество1: 10; Цена1: 0,162; Количество2: 100; Цена2: 0,107; Разрешен к применению: True; PartNumber: SMBJ30A-TR_STMicroelectronics; ManufacturerPartNumber: SMBJ30A-TR; Manufacturer: STMicroelectronics; ComponentLink3URL: http://www.st.com/web/en/resource/technical/document/datasheet/CD00001366.pdf; ComponentLink3Description: Datasheet; Value: SMBJ30A-TR; ComponentLink2Description: Manufacturer Link; ComponentLink2URL: http://www.st.com; Operating Temperature: -55°C ~ +150°C; Modify: 14.08.2015 15:52:42; Supplier: Digi-Key; Supplier P/N: 497-7452-1-ND; Package Description: Корпус DO-214AA
XP?#1 = DS1021-1x5_Сonnfly: ValueBOM: Вилка  DS1021-1x5 "Сonnfly"; Автор: Ткаченко М.; Количество1: шт.1; Цена1: 0,3; Количество2: 10; Цена2: 0,1; Разрешен к применению: True; PartNumber: DS1021-1x5_Сonnfly; ManufacturerPartNumber: DS1021-1x5; Manufacturer: Сonnfly; ComponentLink3URL: https://static.chipdip.ru/lib/227/DOC000227157.pdf; ComponentLink3Description: Datasheet; Value: DS1021-1x5; ComponentLink2Description: Manufacturer Link; ComponentLink2URL: http://www.connfly.com/; Operating Temperature: -40°C ~ +85°C; Modify: 11.02.2019 10:50:54; Supplier: ChipDip; Supplier P/N: 707998901
XP?#2 XP?#3 = PLS2-2_CONNFLY: ValueBOM: Вилка  PLS2-2 "CONNFLY"; Количество1: 1; Цена1: 0; Количество2: 10; Разрешен к применению: True; Net_Name2: Term; PartNumber: PLS2-2_CONNFLY; ManufacturerPartNumber: PLS2-2; Manufacturer: CONNFLY; ComponentLink3URL: http://www.platan.ru/pdf/datasheets/xn/113.pdf; ComponentLink3Description: Datasheet; Value: PLS2-2; ComponentLink2Description: Manufacturer Link; ComponentLink2URL: http://www.connfly.com/; Operating Temperature: -40°C ~ +100°C; Modify: 01.06.2016 11:25:57; Цена2: 0
XT?#1 XT?#2 = PAD1.3x0.8_Контактмодуль: отверстие сигнальных цепей; Автор: Ткаченко М.; Количество1: 0; Разрешен к применению: True; NET_NAME: *; PartNumber: PAD1.3x0.8_Контактмодуль; Manufacturer: Контактмодуль; ManufacturerPartNumber: PAD1.3x0.8; ComponentLink3Description: Datasheet; Value: PAD1.3x0.8; ComponentLink2Description: Manufacturer Link; Modify: 15.02.2016 15:20:49; Package Description: 111; Цена1: 0; Количество2: 0; Цена2: 0
ZQ? = ABM3-8.000MHZ-D2Y-T_Abracon LLC: 8MHz ±20ppm Crystal 18pF 140 Ohm -40°C ~ 85°C Surface Mount 2-SMD; ValueBOM: Резонатор кварцевый ABM3-8.000MHZ-D2Y-T "Abracon LLC"; Автор: Хоменко С.П.; Количество1: 1; Цена1: 0,69; Количество2: 10; Цена2: 0,579; Разрешен к применению: True; PartNumber: ABM3-8.000MHZ-D2Y-T_Abracon LLC; Manufacturer: Abracon LLC; ManufacturerPartNumber: ABM3-8.000MHZ-D2Y-T; ComponentLink3URL: http://www.abracon.com/Resonators/abm3.pdf; ComponentLink3Description: Datasheet; Value: ABM3-8.000MHZ-D2Y-T; Tolerance: ±20ppm; ComponentLink2Description: Manufacturer Link; ComponentLink2URL: http://www.abracon.com; Operating Temperature: -40°C ~ +85°C; Modify: 20.01.2016; Supplier: Digi-Key; Supplier P/N: 535-10630-1-ND; Package Description: MINIATURE CERAMIC SMD CRYSTAL 5x3.2 mm

## Sheet List2.SchDoc
size 209 x 297 mm; DrawnBy: Ткаченко; Organization: ООО НПП ''''; DocumentNumber: XXXX.xxxxxx.xxx Ý3; SheetNumber: 1; SheetTotal: 1; Scale: 1:1; PageSetup: Record=PageOptions|CenterHorizontal=False|CenterVertical=False|PrintScale=0.95|XCorrection=0.00|YCorrection=0.00|PrintKind=1|BorderSize=5000000|LeftOffset=0|BottomOffset=0|Orientation=1|PaperLength=1000|PaperWidth=1000|Scale=100|PaperSource=15|PrintQuality=600|MediaType=1|DitherType=10|PaperKind=A4|PrintScaleMode=1; Title2str: Модуль; DocumentType2str: Схема электрическая принципиальная; TitleProject: Модуль; IDENT: XXXX.xxxxxx.xxxÝ3.pdf; ImagePath: XXXX.xxxxxx.xxx; Rule: PcbType=ProtelPcb
Used 2 times, as channels 1, 2. Parts and nets are listed once, with the designators drawn on the sheet.
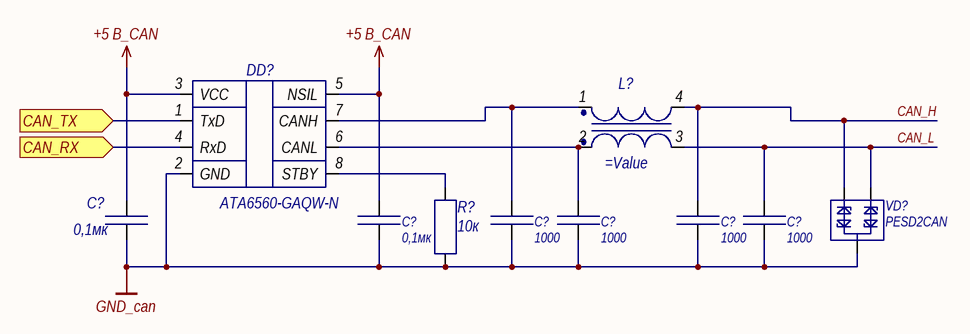
[diagram p1: List2.SchDoc]

### Parts
(Parts that share a designator on the sheet are numbered #1, #2 ... from top to bottom, then left to right.)
C?#1  0,1мк  [CAPC1608N_SL]
C?#2  0,1мк  [CAPC1608N_SL]
C?#3  1000  [CAPC1608N_SL]
C?#4  1000  [CAPC1608N_SL]
C?#5  1000  [CAPC1608N_SL]
C?#6  1000  [CAPC1608N_SL]
DD?  ATA6560-GAQW-N  [SOIC-8N]
L?  (no value)  [DR331]
R?  10к  [RESC1608N_SL]
VD?  PESD2CAN  [SOT23-3N]

### Ports
CAN_RX (in), CAN_TX (in)

### Nets
+5 В_CAN: C?#1.1 C?#2.1 DD?.3(VCC) DD?.5(NSIL)
GND_can: C?#1.2 C?#2.2 C?#3.2 C?#4.2 C?#5.2 C?#6.2 DD?.2(GND) R?.1 VD?.3
CAN_H: C?#5.1 L?.4 VD?.2
CAN_L: C?#6.1 L?.3 VD?.1
CAN_RX: DD?.4(RxD) ; port CAN_RX
CAN_TX: DD?.1(TxD) ; port CAN_TX
NetC?#3_1: C?#3.1 DD?.7(CANH) L?.1
NetC?#4_1: C?#4.1 DD?.6(CANL) L?.2
NetDD?_8: DD?.8(STBY) R?.2

### Channels
1: designators C?=C?_1#2 C?=C?_1#3 C?=C?_1#4 C?=C?_1#5 C?=C?_1#6 C?=C?_1#1 DD?=DD?_1 L?=L?_1 R?=R?_1 VD?=VD?_1; ports CAN_RX=CAN1_RX CAN_TX=CAN1_TX
2: designators C?=C?_2#2 C?=C?_2#3 C?=C?_2#4 C?=C?_2#5 C?=C?_2#6 C?=C?_2#1 DD?=DD?_2 L?=L?_2 R?=R?_2 VD?=VD?_2; ports CAN_RX=CAN2_RX CAN_TX=CAN2_TX

### Notes on the sheet
- Подп. и дата
- Инв. № дубл.
- Взам. инв. №
- Инв. № подл.
- Лист
- Изм.
- № докум.
- Подп.
- Дата
- Копировал
- Фотмат А4

### Library data of the parts
C?#1 = CC0603KRX7R0BB104_Yageo: as C?#1 on sheet List1; PartNumber: CC0603KRX7R0BB104_Yageo; ManufacturerPartNumber: CC0603KRX7R0BB104; ComponentLink3URL: http://www.yageo.com/documents/recent/UPY-NP0X7R_MV_100-to-630V_18.pdf; ComponentLink3Description: Datasheet; Value: 0,1мк; Tolerance: ± 10 %; TKE: X7R; ComponentLink2Description: Manufacturer Link; ComponentLink2URL: http://www.yageo.com/; Operating Temperature: -55°C ~ +125°C; Modify: 27.02.2017 8:51:43; Supplier: Digi-Key; Supplier P/N: 311-1523-1-ND
C?#2 = CC0603KRX7R9BB104_Yageo: as C?#40 on sheet List1; PartNumber: CC0603KRX7R9BB104_Yageo; ManufacturerPartNumber: CC0603KRX7R9BB104; ComponentLink3URL: http://www.yageo.com/documents/recent/UPY-GPHC_X7R_6.3V-to-50V-v12.pdf; ComponentLink3Description: Datasheet; Value: 0,1мк; Tolerance: ± 10 %; TKE: X7R; ComponentLink2Description: Manufacturer Link; ComponentLink2URL: http://www.yageo.com/; Operating Temperature: -55°C ~ +125°C; Modify: 06.07.2015; Supplier: Digi-Key; Supplier P/N: 311-1344-1-ND
C?#3-C?#6 = GCM1885C1H102JA16D: CAP CER 1000PF 50V NP0 0603; ValueBOM: Конденсатор GCM1885C1H102JA16D "Murata" (1000 пФ± 10 %, 50 В, C0G, SMD 0603); Value: 1000; Supplier 1: Digi-Key; Supplier Part Number 1: 490-4768-1-ND
DD? = ATA6560-GAQW-N_Microchip Technology: INDUSTRIAL GRADE CAN TRX WITH NS; ValueBOM: Микросхема  ATA6560-GAQW-N "Microchip Technology" SOIC-8; Автор: Ткаченко М.; Количество1: 1; Цена1: 0,55; Количество2: 25; Цена2: 0,45; Разрешен к применению: True; PartNumber: ATA6560-GAQW-N_Microchip Technology; ManufacturerPartNumber: ATA6560-GAQW-N; Manufacturer: Microchip Technology; ComponentLink3URL: http://ww1.microchip.com/downloads/en/DeviceDoc/ATA6560-ATA6561-High-Speed-CAN-Transceiver-DS20005991A.pdf; ComponentLink3Description: Datasheet; Value: ATA6560-GAQW-N; ComponentLink2Description: Manufacturer Link; ComponentLink2URL: http://www.microchip.com/; Operating Temperature: -40°C ~ +85°C; Modify: 15.03.2019 19:43:22; Supplier: Digi-Key; Supplier P/N: ATA6560-GAQW-NCT-ND; Package Description: Leads, Body 4.9x3.9mm, Pitch 1.27mm, IPC Medium Density
L? = DR331-513AE_Bourns Inc.: 51µH @ 100kHz 2 Line Common Mode Choke Surface Mount 500mA DCR 300 mOhm, CAN; ValueBOM: Индуктивность DR331-513AE Bourns Inc.; Marking: 513A; Автор: Хоменко С.П.; Количество1: 10; Цена1: 0,786; Количество2: 250; Цена2: 0,50804; Разрешен к применению: True; PartNumber: DR331-513AE_Bourns Inc.; Manufacturer: Bourns Inc.; ManufacturerPartNumber: DR331-513AE; ComponentLink3URL: http://www.bourns.com/docs/Product-Datasheets/dr331.pdf; ComponentLink3Description: Datasheet; ComponentLink2Description: Manufacturer Link; ComponentLink2URL: http://www.bourns.com; Operating Temperature: -40°C ~ +135°C; Modify: 24.03.2017 10:04:07; Supplier: Digi-Key; Supplier P/N: DR331-513AECT-ND
R? = RC0603JR-0710KL_Yageo: as R?#7 on sheet List1; PartNumber: RC0603JR-0710KL_Yageo; ManufacturerPartNumber: RC0603JR-0710KL; ComponentLink3URL: http://www.yageo.com/NewPortal/yageodocoutput?fileName=/pdf/R-Chip/PYu-RC_Group_51_RoHS_L_3.pdf; ComponentLink3Description: Datasheet; Value: 10к; Tolerance: ± 5 %; ComponentLink2Description: Manufacturer Link; ComponentLink2URL: http://www.yageo.com/; Operating Temperature: -55°C ~ +125°C; Modify: 12.08.2015 22:38:32; Supplier: Digi-Key; Supplier P/N: 311-10KGRCT-ND; Package Description: Chip Resistor, Body 1.6x0.8mm, IPC Medium Density
VD? = PESD2CAN,215_NXP Semiconductors: TVS DIODE 24VWM 41VC SOT23 CAN bus protection; ValueBOM: Трансил, сборка PESD2CAN,215 "NXP Semiconductors" SOT23-3; Marking: 6R; Автор: Хоменко С.П.; Количество1: 10; Цена1: 0,406; Количество2: 25; Цена2: 0,333; Разрешен к применению: True; PartNumber: PESD2CAN,215_NXP Semiconductors; ManufacturerPartNumber: PESD2CAN,215; Manufacturer: NXP Semiconductors; ComponentLink3URL: http://www.nxp.com/documents/data_sheet/PESD2CAN.pdf; ComponentLink3Description: Datasheet; Value: PESD2CAN,215; ComponentLink2Description: Manufacturer Link; ComponentLink2URL: http://www.nxp.com/; Operating Temperature: -55°C ~ +150°C; Modify: 12.08.2015 14:44:58; Supplier: Digi-Key; Supplier P/N: 568-4147-1-ND; Package Description: SOT23, 3-Leads, Body 2.9x1.3mm, Pitch 0.95mm, Lead Span 2.5mm, IPC Medium Density

## Nets that join several sheets
+5 В_CAN: List1 (5 pins), 1 (C?_1#1.1 C?_1#2.1 DD?_1.3 DD?_1.5), 2 (C?_2#1.1 C?_2#2.1 DD?_2.3 DD?_2.5)
GND_can: List1 (7 pins), 1 (9 pins), 2 (9 pins)
CAN1_RX: List1 (DD?#3.12), 1 (DD?_1.4)
CAN1_TX: List1 (DD?#3.13), 1 (DD?_1.1)
CAN2_RX: List1 (DD?#3.11), 2 (DD?_2.4)
CAN2_TX: List1 (DD?#3.14), 2 (DD?_2.1)